# Altium schematic sheet FPGA_extFLASH.SchDoc
size 420 x 297 mm; SheetNumber: 31; SheetTotal: 32
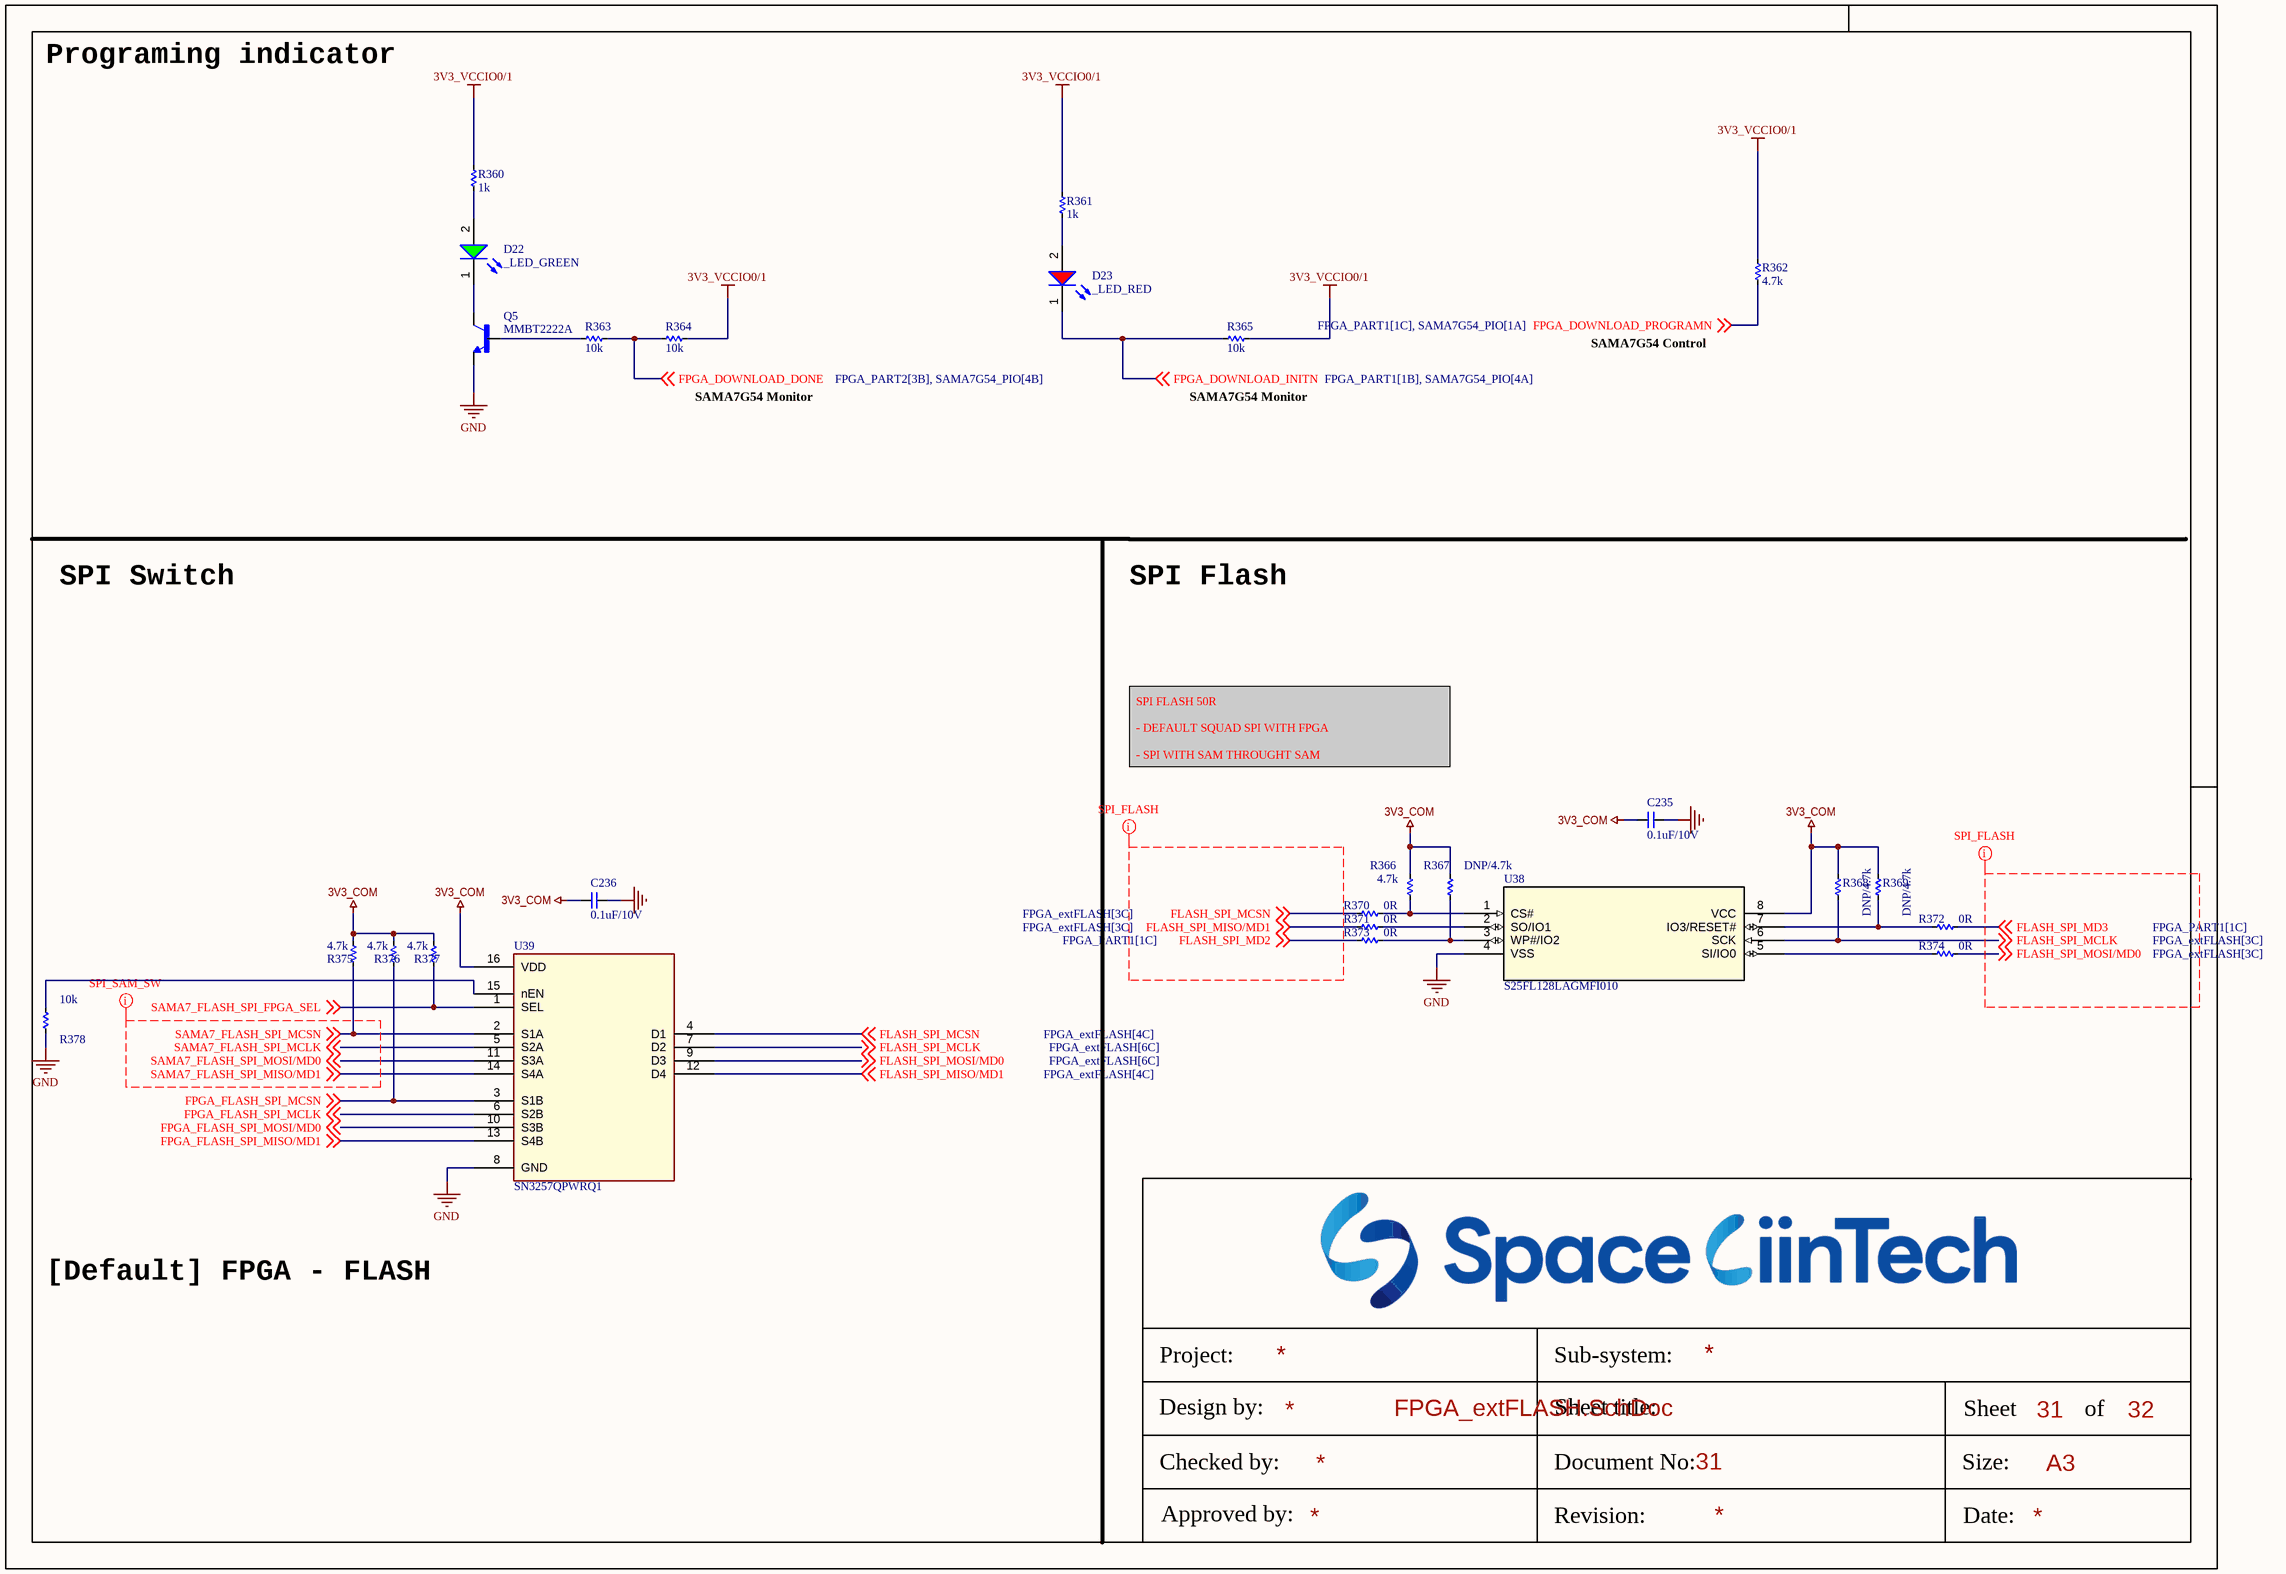
[diagram p0: FPGA_extFLASH.SchDoc]

## Parts
C235  0.1uF/10V  [CAP_C_1005X50_L]
C236  0.1uF/10V  [CAP_C_1005X50_L]
D22  _LED_GREEN  [LED_0603]
D23  _LED_RED  [LED_0603]
Q5  MMBT2222A  [SOT95P240X120-3N]
R360  1k  [RES_C_1005x30_L]
R361  1k  [RES_C_1005x30_L]
R362  4.7k  [RES_C_1005x30_L]
R363  10k  [RES_C_1005x30_L]
R364  10k  [RES_C_1005x30_L]
R365  10k  [RES_C_1005x30_L]
R366  4.7k  [RES_C_1005x30_L]
R367  DNP/4.7k  [RES_C_1005x30_L]
R368  DNP/4.7k  [RES_C_1005x30_L]
R369  DNP/4.7k  [RES_C_1005x30_L]
R370  0R  [RES_C_1005x30_L]
R371  0R  [RES_C_1005x30_L]
R372  0R  [RES_C_1005x30_L]
R373  0R  [RES_C_1005x30_L]
R374  0R  [RES_C_1005x30_L]
R375  4.7k  [RES_C_1005x30_L]
R376  4.7k  [RES_C_1005x30_L]
R377  4.7k  [RES_C_1005x30_L]
R378  10k  [RES_C_1005x30_L]
U38  S25FL128LAGMFI010  [SOIC8_S25FL_CYP]
U39  SN3257QPWRQ1  [SOIC_PRQ1_TEX]

## Nets
3V3_COM: C235.2 C236.2 R366.2 R367.2 R368.2 R369.2 R375.2 R376.2 R377.2 U38.8(VCC) U39.16(VDD)
3V3_VCCIO0/1: R360.2 R361.2 R362.2 R364.1 R365.1
GND: C235.1 C236.1 Q5.2(E) R378.1 U38.4(VSS) U39.8(GND)
FLASH_SPI_MCLK: R368.1 U38.6(SCK) U39.7(D2) ; off-sheet FLASH_SPI_MCLK
FLASH_SPI_MCSN: R370.1 U39.4(D1) ; off-sheet FLASH_SPI_MCSN
FLASH_SPI_MD2: R373.1 ; off-sheet FLASH_SPI_MD2
FLASH_SPI_MD3: R372.2 ; off-sheet FLASH_SPI_MD3
FLASH_SPI_MISO/MD1: R371.1 U39.12(D4) ; off-sheet FLASH_SPI_MISO/MD1
FLASH_SPI_MOSI/MD0: R374.2 U39.9(D3) ; off-sheet FLASH_SPI_MOSI/MD0
FPGA_DOWNLOAD_DONE: R363.1 R364.2 ; off-sheet FPGA_DOWNLOAD_DONE
FPGA_DOWNLOAD_INITN: D23.1(K) R365.2 ; off-sheet FPGA_DOWNLOAD_INITN
FPGA_DOWNLOAD_PROGRAMN: R362.1 ; off-sheet FPGA_DOWNLOAD_PROGRAMN
FPGA_FLASH_SPI_MCLK: U39.6(S2B) ; off-sheet FPGA_FLASH_SPI_MCLK
FPGA_FLASH_SPI_MCSN: R376.1 U39.3(S1B) ; off-sheet FPGA_FLASH_SPI_MCSN
FPGA_FLASH_SPI_MISO/MD1: U39.13(S4B) ; off-sheet FPGA_FLASH_SPI_MISO/MD1
FPGA_FLASH_SPI_MOSI/MD0: U39.10(S3B) ; off-sheet FPGA_FLASH_SPI_MOSI/MD0
SAMA7_FLASH_SPI_FPGA_SEL: R377.1 U39.1(SEL) ; off-sheet SAMA7_FLASH_SPI_FPGA_SEL
SAMA7_FLASH_SPI_MCLK: U39.5(S2A) ; off-sheet SAMA7_FLASH_SPI_MCLK
SAMA7_FLASH_SPI_MCSN: R375.1 U39.2(S1A) ; off-sheet SAMA7_FLASH_SPI_MCSN
SAMA7_FLASH_SPI_MISO/MD1: U39.14(S4A) ; off-sheet SAMA7_FLASH_SPI_MISO/MD1
SAMA7_FLASH_SPI_MOSI/MD0: U39.11(S3A) ; off-sheet SAMA7_FLASH_SPI_MOSI/MD0
NetD22_1: D22.1(K) Q5.3(C)
NetD22_2: D22.2(A) R360.1
NetD23_2: D23.2(A) R361.1
NetQ5_1: Q5.1(B) R363.2
NetR366_1: R366.1 R370.2 U38.1(CS#)
NetR367_1: R367.1 R373.2 U38.3(WP#/IO2)
NetR369_1: R369.1 R372.1 U38.7(IO3/RESET#)
NetR371_2: R371.2 U38.2(SO/IO1)
NetR374_1: R374.1 U38.5(SI/IO0)
NetR378_2: R378.2 U39.15(nEN)

## Layout directives
net class FLASH_SAM_FPGA: FLASH_SPI_MCLK, FLASH_SPI_MCSN, FLASH_SPI_MD2, FLASH_SPI_MD3, FLASH_SPI_MISO/MD1, FLASH_SPI_MOSI/MD0
mark named SPI_SAM_SW: SAMA7_FLASH_SPI_MCLK, SAMA7_FLASH_SPI_MCSN, SAMA7_FLASH_SPI_MISO/MD1, SAMA7_FLASH_SPI_MOSI/MD0

## Notes on the sheet
- Programing indicator
- SAMA7G54 Control
- SAMA7G54 Monitor
- (near R365) SAMA7G54 Monitor
- SPI Switch
- SPI Flash
- SPI FLASH 50R
  - DEFAULT SQUAD SPI WITH FPGA
  - SPI WITH SAM THROUGHT SAM
- [Default] FPGA - FLASH
- Project:
- Sub-system:
- Design by:
- Sheet title:
- Sheet
- A3
- of
- Checked by:
- Approved by:
- Revision:
- Document No:
- Size:
- Date:

## Library data of the parts
C235 C236 = _CAP_C_2: CAP
D22 = LED_GREEN: LED GREEN CLEAR 0603 SMD
D23 = LED_RED: LED RED CLEAR 0603 SMD
Q5 = BJT_NPN_BEC: MF: Diotec Semiconductor; SnapEDA_Link: https://www.snapeda.com/parts/MMBT2222A/Diotec/view-part/?ref=snap; Package: SOT-23 Diotec; Value: *; MP: MMBT2222A; Check_prices: https://www.snapeda.com/parts/MMBT2222A/Diotec/view-part/?ref=eda
R360-R378 = _RES_B_2: RES
U38 = S25FL128LAGMFI010: Description; Manufacturer_Name: Cypress Semiconductor; Copyright: Copyright (C) 2025 Ultra Librarian. All rights reserved.; Manufacturer_Part_Number: S25FL128LAGMFI010; RefDes: RefDes; Type: Type
U39 = IC_SW_SPI_SN3257QPWRQ1: Automotive 5-V, 2:1 (SPDT), 4-channel switch with 1.8-V logic and powered-off protection 16-TSSOP -40 to 125; Manufacturer_Name: Texas Instruments; Copyright: Copyright (C) 2025 Ultra Librarian. All rights reserved.; Manufacturer_Part_Number: SN3257QPWRQ1; Datasheet: https://www.ti.com/lit/gpn/sn3257-q1; RefDes: RefDes; Type: Type